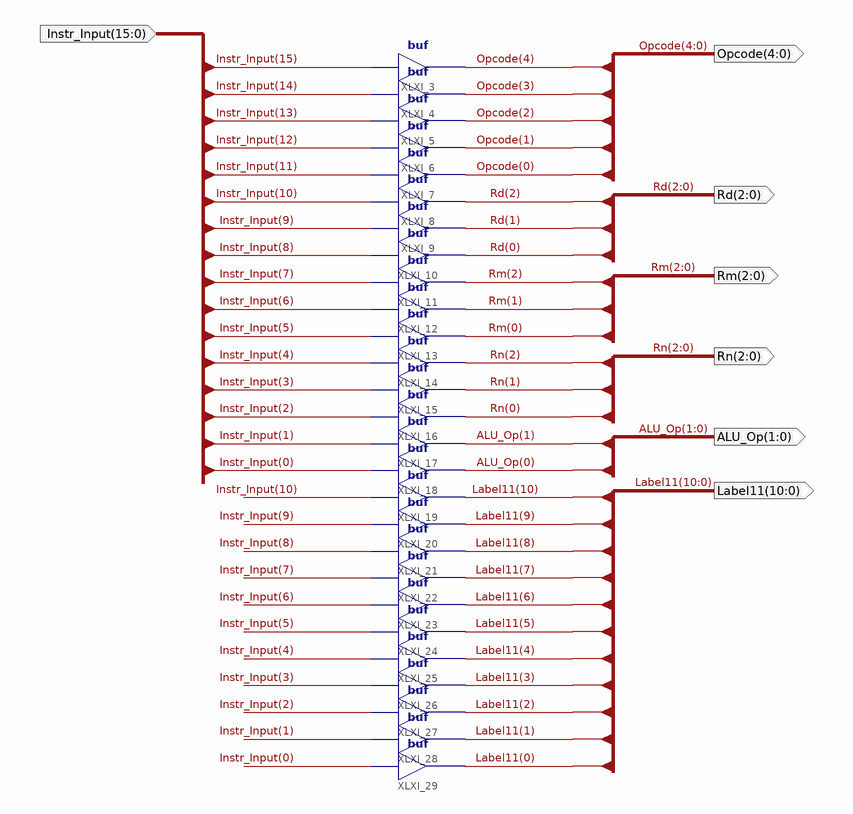
[diagram p0: schematic sheet 1]
// Xilinx ISE schematic Instr_Parser.sch (virtex6) as structural Verilog: 27 symbols, 7 ports
module Instr_Parser (
  input  [15:0] Instr_Input,
  output [4:0] Opcode,
  output [2:0] Rd,
  output [2:0] Rm,
  output [2:0] Rn,
  output [1:0] ALU_Op,
  output [10:0] Label11
);

  buf XLXI_3 (Opcode[4], Instr_Input[15]);
  buf XLXI_4 (Opcode[3], Instr_Input[14]);
  buf XLXI_5 (Opcode[2], Instr_Input[13]);
  buf XLXI_6 (Opcode[1], Instr_Input[12]);
  buf XLXI_7 (Opcode[0], Instr_Input[11]);
  buf XLXI_8 (Rd[2], Instr_Input[10]);
  buf XLXI_9 (Rd[1], Instr_Input[9]);
  buf XLXI_10 (Rd[0], Instr_Input[8]);
  buf XLXI_11 (Rm[2], Instr_Input[7]);
  buf XLXI_12 (Rm[1], Instr_Input[6]);
  buf XLXI_13 (Rm[0], Instr_Input[5]);
  buf XLXI_14 (Rn[2], Instr_Input[4]);
  buf XLXI_15 (Rn[1], Instr_Input[3]);
  buf XLXI_16 (Rn[0], Instr_Input[2]);
  buf XLXI_17 (ALU_Op[1], Instr_Input[1]);
  buf XLXI_18 (ALU_Op[0], Instr_Input[0]);
  buf XLXI_19 (Label11[10], Instr_Input[10]);
  buf XLXI_20 (Label11[9], Instr_Input[9]);
  buf XLXI_21 (Label11[8], Instr_Input[8]);
  buf XLXI_22 (Label11[7], Instr_Input[7]);
  buf XLXI_23 (Label11[6], Instr_Input[6]);
  buf XLXI_24 (Label11[5], Instr_Input[5]);
  buf XLXI_25 (Label11[4], Instr_Input[4]);
  buf XLXI_26 (Label11[3], Instr_Input[3]);
  buf XLXI_27 (Label11[2], Instr_Input[2]);
  buf XLXI_28 (Label11[1], Instr_Input[1]);
  buf XLXI_29 (Label11[0], Instr_Input[0]);
endmodule
